# EAGLE design Low-profile_SD (EAGLE 6.4)
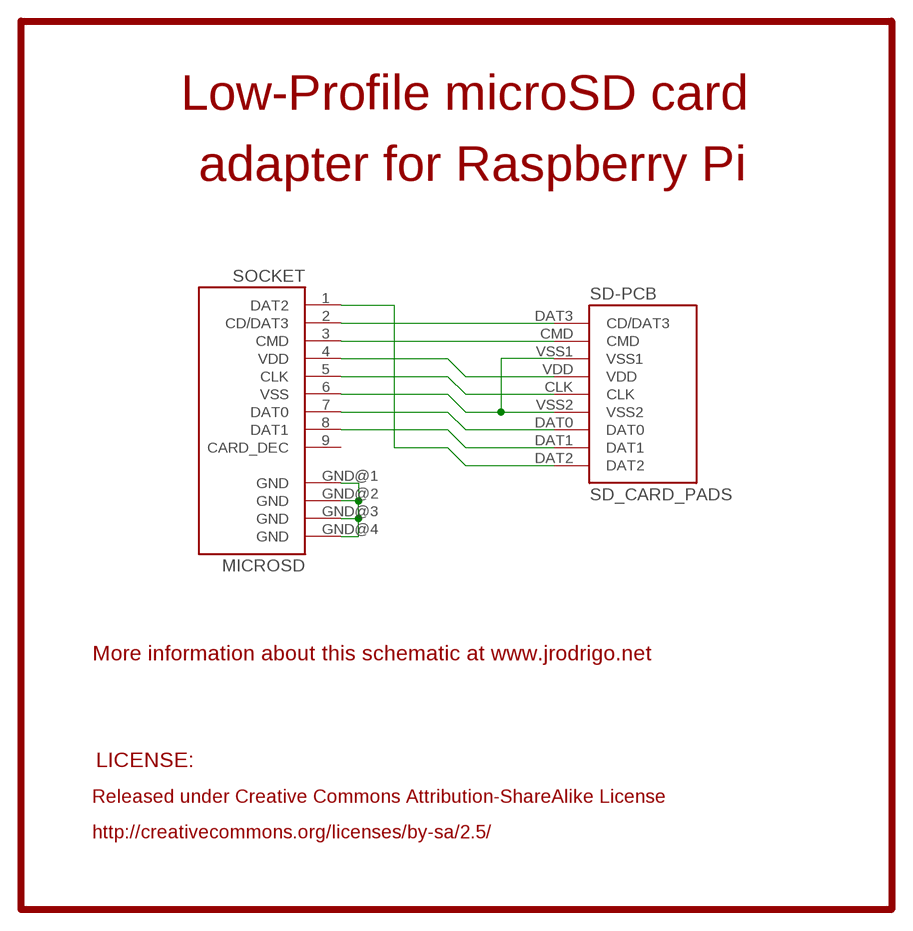
[diagram p0: schematic, sheet 1]

## Parts
SD-PCB  SD_CARD_PADS  [SD_PADS]
SOCKET  MICROSD  [MICROSD_PP]

## Nets
GND: SOCKET.GND@1(GND) SOCKET.GND@2(GND) SOCKET.GND@3(GND) SOCKET.GND@4(GND)
N$1: SD-PCB.DAT3(CD/DAT3) SOCKET.2(CD/DAT3)
N$2: SD-PCB.CMD SOCKET.3(CMD)
N$3: SD-PCB.VDD SOCKET.4(VDD)
N$4: SD-PCB.CLK SOCKET.5(CLK)
N$5: SD-PCB.VSS1 SD-PCB.VSS2 SOCKET.6(VSS)
N$6: SD-PCB.DAT0 SOCKET.7(DAT0)
N$7: SD-PCB.DAT1 SOCKET.8(DAT1)
N$8: SD-PCB.DAT2 SOCKET.1(DAT2)
Unconnected: SOCKET.9(CARD_DEC)

## Notes on the sheet
- Low-Profile microSD card
- adapter for Raspberry Pi
- More information about this schematic at www.jrodrigo.net
- LICENSE:
- Released under Creative Commons Attribution-ShareAlike License
- http://creativecommons.org/licenses/by-sa/2.5/

## Library data of the parts
SD-PCB = ardublog-jra:SD_CARD_PADS
SOCKET = ardublog-jra:MICROSD

## Board
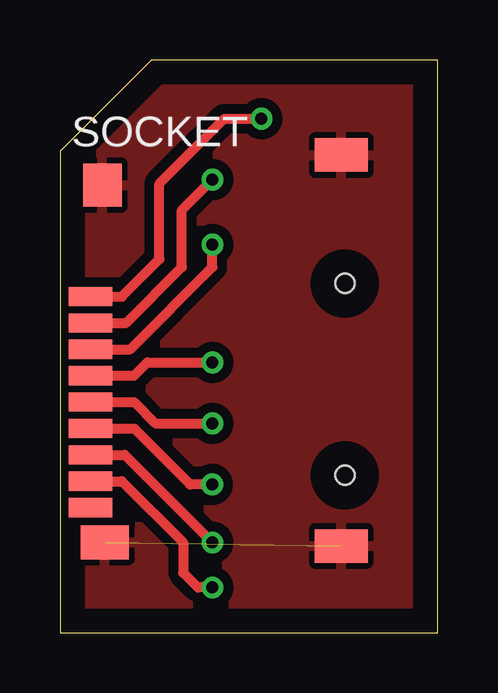
[diagram p1: board, top side]
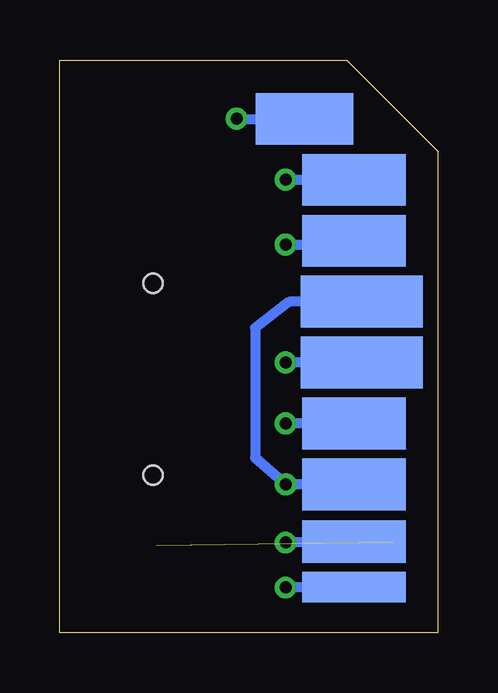
[diagram p2: board, bottom side, seen from below]

Size 15.75 x 23.88 mm. Coordinates in mm from the lower left corner, seen from the top.
Outline: 0,0 15.75,0 15.75,23.88 3.81,23.88 0,20.07 0,0
Copper layers (1*16): Top 0.035mm / dielectric 1.5mm / Bottom 0.035mm
Design rules "default": minimum track width 10mil, minimum drill 24mil, track to track 8mil, track to pad 8mil, pad to pad 8mil, via to via 8mil, smd to smd 8mil, copper to edge 40mil, drill to drill 8mil, minimum pad ring 10mil, minimum via ring 8mil, stop-mask expansion 4mil, vias tented up to drill 0mil, thermal gap 10mil

### Footprints (pad centres in the part's own frame; a part is rotated, then mirrored left to right if it is on the bottom)
SD_PADS = smd 4.318 x 2.159: CLK -4.128,13.811; CMD -4.128,6.191; DAT3 -4.128,3.651; VSS2 -4.128,16.351 | smd 4.318 x 1.778: DAT0 -4.128,18.733 | smd 4.318 x 1.27: DAT1 -4.128,20.637 | smd 4.064 x 2.159: DAT2 -2.064,1.111 | smd 5.08 x 2.159: VDD -4.445,11.271; VSS1 -4.445,8.731
MICROSD_PP = smd 1.8 x 0.8: 1 0,3.85; 2 0,2.75; 3 0,1.65; 4 0,0.55; 5 0,-0.55; 6 0,-1.65; 7 0,-2.75; 8 0,-3.85; 9 0,-4.95 | smd 1.6 x 1.8: GND@1 0.5,8.5 | smd 2.2 x 1.4: GND@2 10.45,9.75; GND@4 10.45,-6.55 | smd 2 x 1.4: GND@3 0.6,-6.4 | hole 0.8: 10.6,4.4; 10.6,-3.6

### Placement (x,y rotation side)
SD-PCB  7.62,22.53 180 bottom
SOCKET  1.27,10.16 0 top

### Tracks (layer width: path | path; a pad name or v marks a point on that pad's centre or on a via)
GND  (1 unrouted)
  pour Top (isolate 0.406): 0,0 15.73,0 15.73,23.85 3.81,23.85 0,20.04
N$1  (via drill 0.5)
  Top 0.406: SOCKET.2 2.75,12.91 5.08,15.24 5.08,17.61 v6.35,18.88
  Bottom 0.406: SD-PCB.DAT3 3.65,19.05 3.64,19.05 3.8,18.88 v6.35,18.88
N$2  (via drill 0.5)
  Top 0.406: SOCKET.3 2.92,11.81 6.35,15.24 v6.35,16.18
  Bottom 0.406: SD-PCB.CMD 3.65,16.51 3.65,16.4 3.64,16.39 3.86,16.18 v6.35,16.18
N$3  (via drill 0.5)
  Top 0.406: SOCKET.4 3.09,10.71 3.64,11.26 v6.35,11.26
  Bottom 0.406: SD-PCB.VDD 3.33,11.43 3.5,11.26 v6.35,11.26
N$4  (via drill 0.5)
  Top 0.406: SOCKET.5 3.09,9.61 3.98,8.72 v6.35,8.72
  Bottom 0.406: SD-PCB.CLK 3.65,8.89 3.82,8.72 v6.35,8.72
N$5  (via drill 0.5)
  Top 0.406: SOCKET.6 3.09,8.51 5.42,6.18 v6.34,6.18
  Bottom 0.406: SD-PCB.VSS1 6.19,13.8 7.62,12.7 7.62,7.29 v6.34,6.18 SD-PCB.VSS2
N$6  (via drill 0.5)
  Top 0.406: v6.35,3.75 6.3,3.81 6.29,3.81 2.69,7.41 SOCKET.7
  Bottom 0.406: SD-PCB.DAT0 3.53,3.75 v6.35,3.75
N$7  (via drill 0.5)
  Top 0.406: SOCKET.8 2.58,6.31 5.13,3.75 5.13,2.48 5.74,1.88 v6.35,1.88
  Bottom 0.406: SD-PCB.DAT1 3.51,1.88 v6.35,1.88
N$8  (via drill 0.5)
  Top 0.406: SOCKET.1 2.58,14.01 4.14,15.57 4.14,18.72 6.85,21.42 v8.39,21.42
  Bottom 0.406: 5.4,21.59 SD-PCB.DAT2 v8.39,21.42